# EAGLE schematic EAA690_RFID_Controller (EAGLE 7.3.0)
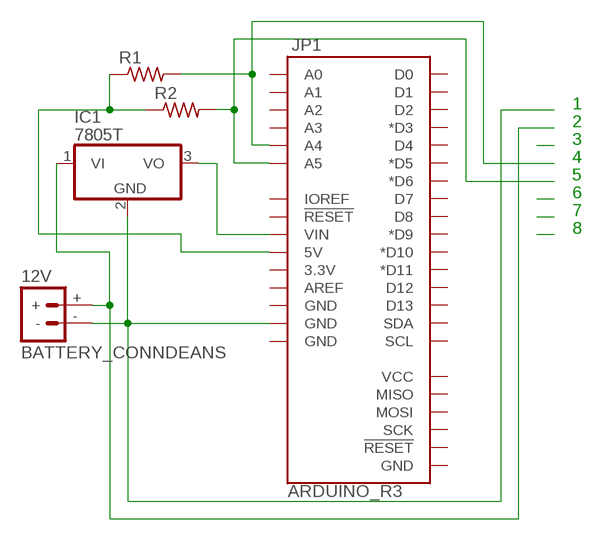
[diagram p0: schematic, sheet 1]

## Parts
12V  BATTERY_CONNDEANS  [DEANS]
IC1  7805T  [TO220H]
JP1  ARDUINO_R3  [ARDUINO_R3]
R1  R-US_0204/5  [0204/5]
R2  R-US_0204/5  [0204/5]

## Nets
N$1: 12V.- IC1.2(GND) JP1.GND@3(GND)
N$2: 12V.+ IC1.1(VI)
N$4: JP1.5V R1.1 R2.1
N$5: JP1.A5 R2.2
N$9: JP1.A4 R1.2
N$10: IC1.3(VO) JP1.VIN
Unconnected: JP1.3.3V JP1.A0 JP1.A1 JP1.A2 JP1.A3 JP1.AREF JP1.D0 JP1.D1 JP1.D2 JP1.D3(*D3) JP1.D4 JP1.D5(*D5) JP1.D6(*D6) JP1.D7 JP1.D8 JP1.D9(*D9) JP1.D10(*D10) JP1.D11(*D11) JP1.D12 JP1.D13 JP1.GND@1(GND) JP1.GND@2(GND) JP1.GND@4(GND) JP1.IOREF JP1.MISO JP1.MOSI JP1.RESET@1(!RESET!) JP1.RESET@2(!RESET!) JP1.SCK JP1.SCL JP1.SDA JP1.VCC

## Notes on the sheet
- 1
- 2
- 3
- 4
- 5
- 6
- 7
- 8

## Library data of the parts
12V = SparkFun-Connectors:BATTERY_CONN: Various footprints for battery connectors
IC1 = linear:78*: Positive VOLTAGE REGULATOR Source: http://cache.national.com/ds/LM/LM78L05.pdf http://www.fairchildsemi.com/ds/LM/LM7805.pdf
JP1 = SparkFun-Boards:ARDUINO_R3: Arduino R3 Footprint (w/ SPI header)
R1 R2 = resistor:R-US_: RESISTOR, American symbol